# Altium schematic sheet LCDTFT_CTRL_FT813.SchDoc
size A3
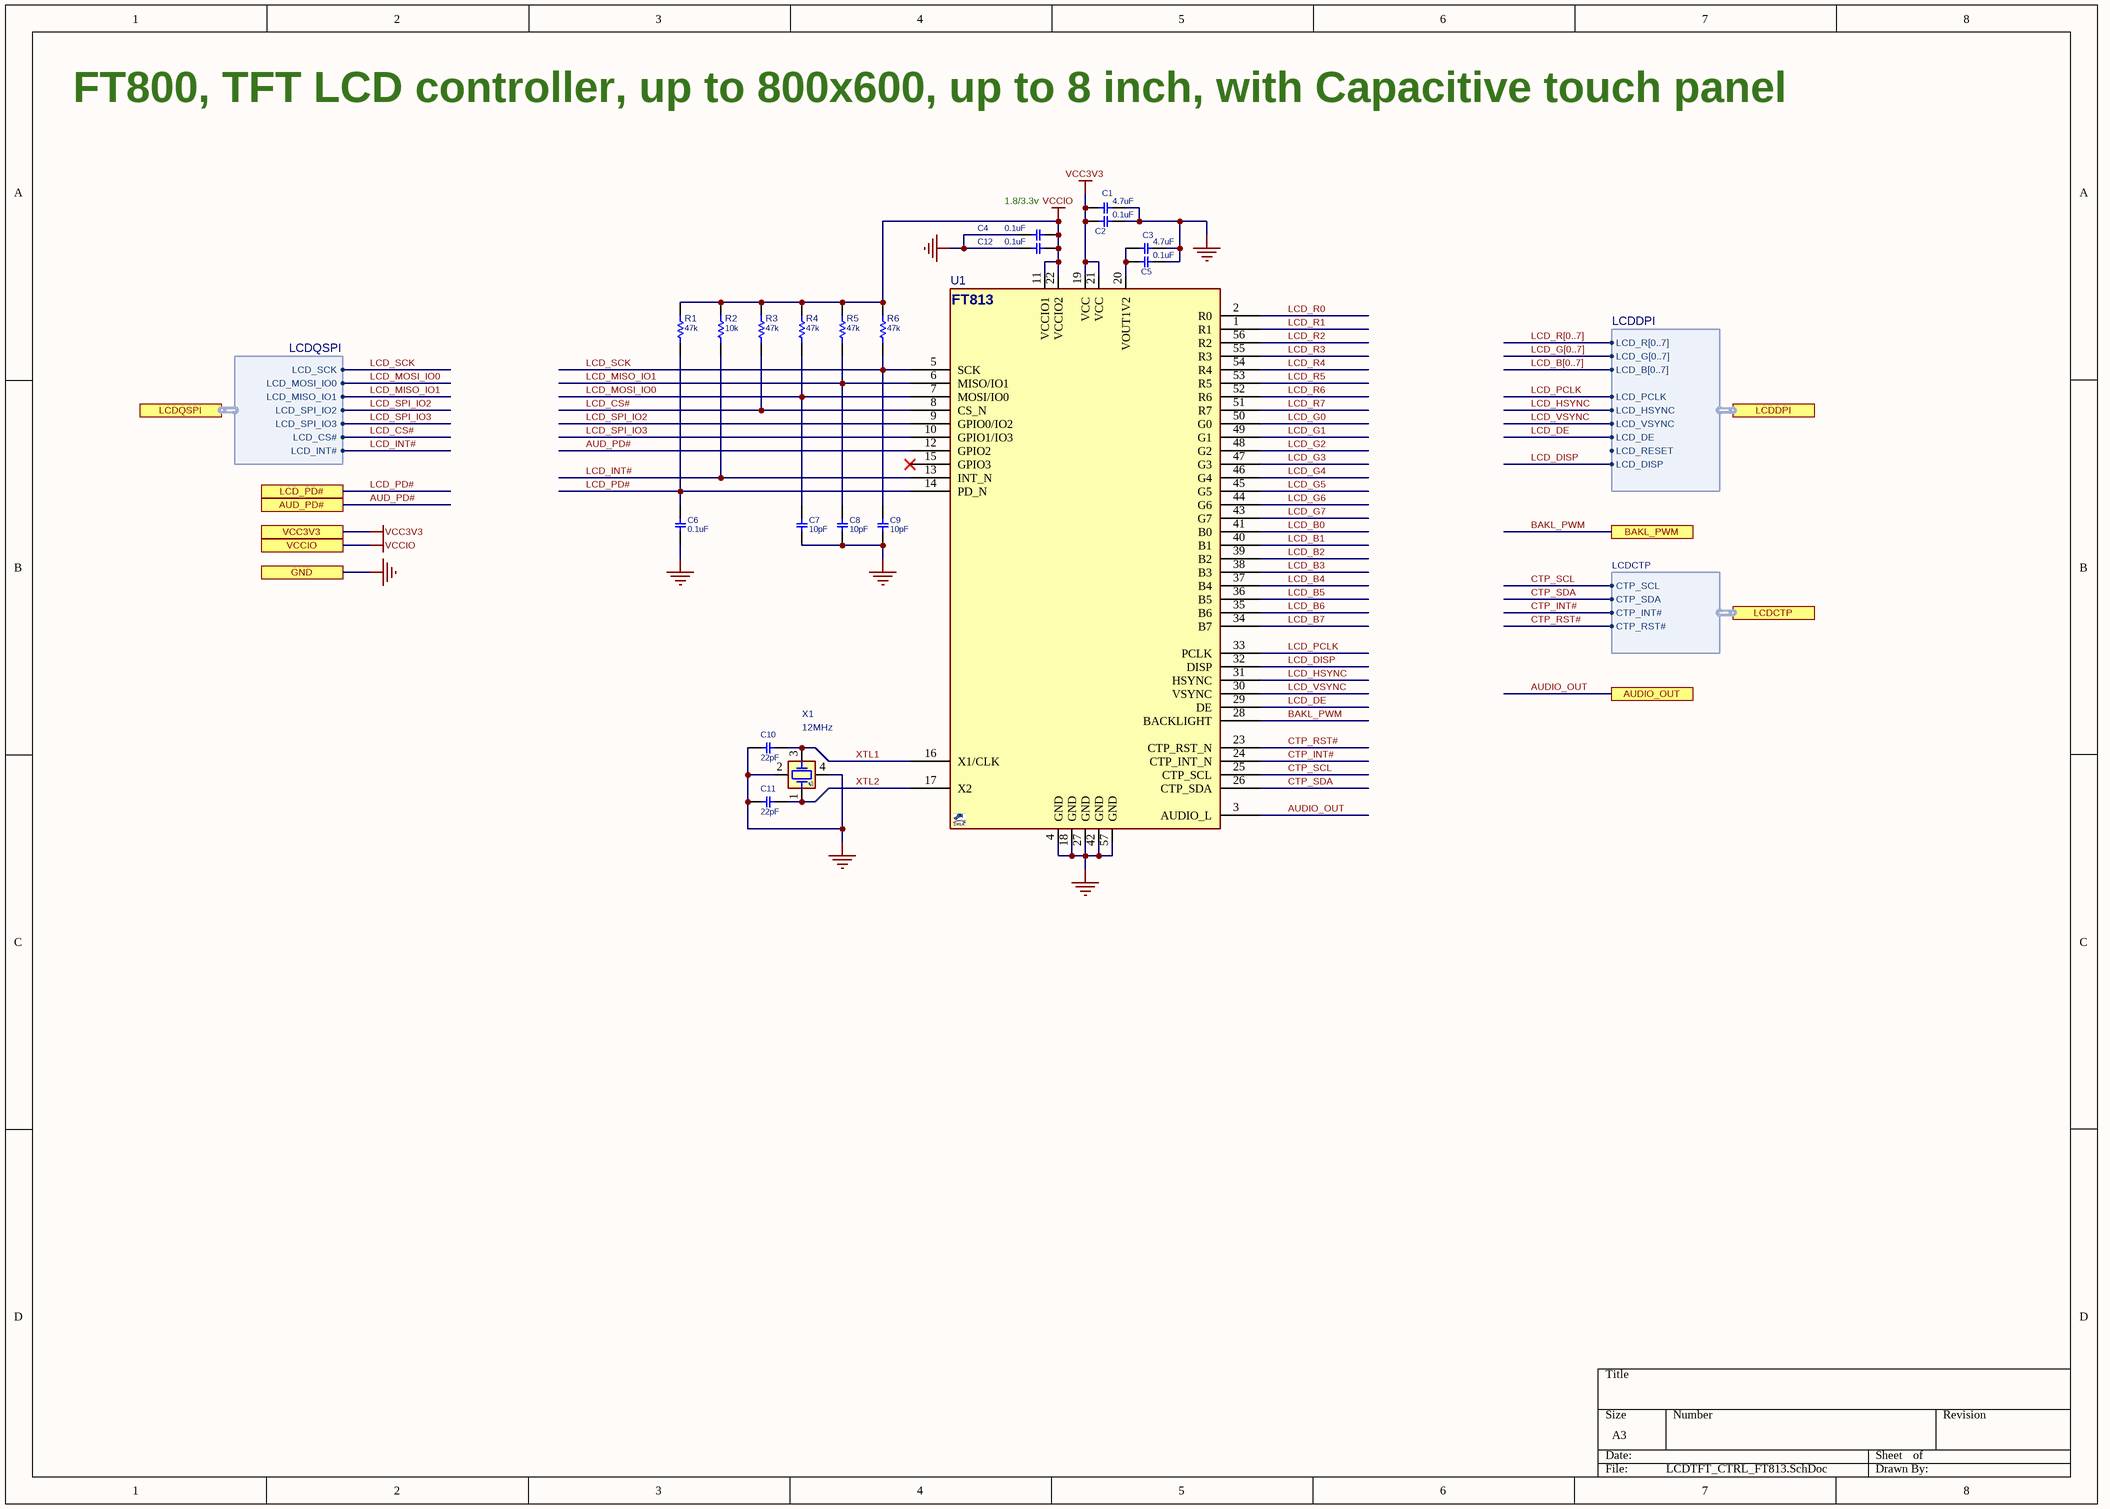
[diagram p0: LCDTFT_CTRL_FT813.SchDoc]

## Parts
C1  4.7uF  [C0603]
C2  0.1uF  [C0402]
C3  4.7uF  [C0603]
C4  0.1uF  [C0402]
C5  0.1uF  [C0402]
C6  0.1uF  [C0402]
C7  10pF  [C0402]
C8  10pF  [C0402]
C9  10pF  [C0402]
C10  22pF  [C0402]
C11  22pF  [C0402]
C12  0.1uF  [C0402]
R1  47k  [R0402]
R2  10k  [R0402]
R3  47k  [R0402]
R4  47k  [R0402]
R5  47k  [R0402]
R6  47k  [R0402]
U1  FT813  [QFN50_56T]  (value not drawn)
X1  12MHz  [XTL_4_3225]

## Ports
AUD_PD#, AUDIO_OUT, BAKL_PWM, GND, LCD_PD#, LCDCTP (harness LCDCTP), LCDDPI (harness LCDDPI), LCDQSPI (harness LCDQSPI), VCC3V3, VCCIO

## Harnesses
LCDDPI: LCD_PCLK, LCD_HSYNC, LCD_VSYNC, LCD_DE, LCD_R[0..7], LCD_G[0..7], LCD_B[0..7], LCD_RESET, LCD_DISP
LCDQSPI: LCD_SCK, LCD_MISO_IO1, LCD_MOSI_IO0, LCD_SPI_IO2, LCD_SPI_IO3, LCD_CS#, LCD_INT#
LCDCTP: CTP_SCL, CTP_SDA, CTP_INT#, CTP_RST#

## Nets
GND: C1.1 C2.1 C3.1 C4.2 C5.1 C6.2 C7.2 C8.2 C9.2 C10.1 C11.2 C12.2 U1.4(GND) U1.18(GND) U1.27(GND) U1.42(GND) U1.57(GND) X1.2 X1.4 ; port GND
VCC3V3: C1.2 C2.2 U1.19(VCC) U1.21(VCC) ; port VCC3V3
VCCIO: C4.1 C12.1 R1.1 R2.1 R3.1 R4.1 R5.1 R6.1 U1.11(VCCIO1) U1.22(VCCIO2) ; port VCCIO
AUD_PD#: U1.12(GPIO2) ; port AUD_PD#
AUDIO_OUT: U1.3(AUDIO_L) ; port AUDIO_OUT
BAKL_PWM: U1.28(BACKLIGHT) ; port BAKL_PWM
CTP_INT#: U1.24(CTP_INT_N) ; port LCDCTP.CTP_INT#
CTP_RST#: U1.23(CTP_RST_N) ; port LCDCTP.CTP_RST#
CTP_SCL: U1.25(CTP_SCL) ; port LCDCTP.CTP_SCL
CTP_SDA: U1.26(CTP_SDA) ; port LCDCTP.CTP_SDA
LCD_B0: U1.41(B0)
LCD_B1: U1.40(B1)
LCD_B2: U1.39(B2)
LCD_B3: U1.38(B3)
LCD_B4: U1.37(B4)
LCD_B5: U1.36(B5)
LCD_B6: U1.35(B6)
LCD_B7: U1.34(B7)
LCD_CS#: R3.2 U1.8(CS_N) ; port LCDQSPI.LCD_CS#
LCD_DE: U1.29(DE) ; port LCDDPI.LCD_DE
LCD_DISP: U1.32(DISP) ; port LCDDPI.LCD_DISP
LCD_G0: U1.50(G0)
LCD_G1: U1.49(G1)
LCD_G2: U1.48(G2)
LCD_G3: U1.47(G3)
LCD_G4: U1.46(G4)
LCD_G5: U1.45(G5)
LCD_G6: U1.44(G6)
LCD_G7: U1.43(G7)
LCD_HSYNC: U1.31(HSYNC) ; port LCDDPI.LCD_HSYNC
LCD_INT#: R2.2 U1.13(INT_N) ; port LCDQSPI.LCD_INT#
LCD_MISO_IO1: C8.1 R5.2 U1.6(MISO/IO1) ; port LCDQSPI.LCD_MISO_IO1
LCD_MOSI_IO0: C7.1 R4.2 U1.7(MOSI/IO0) ; port LCDQSPI.LCD_MOSI_IO0
LCD_PCLK: U1.33(PCLK) ; port LCDDPI.LCD_PCLK
LCD_PD#: C6.1 R1.2 U1.14(PD_N) ; port LCD_PD#
LCD_R0: U1.2(R0)
LCD_R1: U1.1(R1)
LCD_R2: U1.56(R2)
LCD_R3: U1.55(R3)
LCD_R4: U1.54(R4)
LCD_R5: U1.53(R5)
LCD_R6: U1.52(R6)
LCD_R7: U1.51(R7)
LCD_SCK: C9.1 R6.2 U1.5(SCK) ; port LCDQSPI.LCD_SCK
LCD_SPI_IO2: U1.9(GPIO0/IO2) ; port LCDQSPI.LCD_SPI_IO2
LCD_SPI_IO3: U1.10(GPIO1/IO3) ; port LCDQSPI.LCD_SPI_IO3
LCD_VSYNC: U1.30(VSYNC) ; port LCDDPI.LCD_VSYNC
XTL1: C10.2 U1.16(X1/CLK) X1.3
XTL2: C11.1 U1.17(X2) X1.1
NetC3_2: C3.2 C5.2 U1.20(VOUT1V2)

Not connected (* = marked no-connect by the designer): U1 15(GPIO3)*

## Buses and harness runs
bus LCD_B[0..7]
bus LCD_G[0..7]
bus LCD_R[0..7]

## Notes on the sheet
- FT800, TFT LCD controller, up to 800x600, up to 8 inch, with Capacitive touch panel
- 1.8/3.3v

## Library data of the parts
C1 C3 = CAP_SMD_MLCC: CAP, MLCC; PARAM: X5R, 10%; PRICE: 50,000:	$0.006; MANF_P#: -; MANF: -; PARAM2: -; ASSEMBLY: ASSEMBLY; VALUE: 4.7uF
C2 C4-C6 C12 = CAP_SMD_MLCC: CAP, MLCC; PARAM: X7R, 10%, -55~125oC; MANF_P#: GRM155R71H104KE14D; MANF: Murata; PARAM2: 50v; PRICE: 100: 0.018$; ASSEMBLY: ASSEMBLY; VALUE: 0.1uF
C7-C11 = CAP_SMD_MLCC: CAP, MLCC; PARAM2: 50v; PARAM: -; PRICE: 100: 0.018$; MANF_P#: -; MANF: -; ASSEMBLY: ASSEMBLY
  C7-C9: VALUE: 10pF
  C10 C11: VALUE: 22pF
R1-R6 = RES_SMD: RESISTOR, SMD; PARAM: 0.063W; DESC: DESCRIPTION; DIST#: MOUSER; PARAM2: 1%; MANF_P#: -; MANF: -; ASSEMBLY: ASSEMBLY; PRICE: 100= 0.3$
  R1 R3-R6: VALUE: 47k
  R2: VALUE: 10k
U1 = FT813_QFN56: LCD Display Controller, Embedded Video Engine, QFN-56; MANF: FTDI/Bridgetek; MANF_P#: FT813Q; PARAM2: 1.8~3.3Vcc; PARAM: -40~85°C; PRICE: 5$; VALUE: FT813
X1 = XTL_4_12MHz_3225: Crystal 12MHz; MANF: ECS; MANF_P#: ECS-120-18-33-JEM-TR; PARAM: 20PPM, 18pF; PRICE: 0.5$; VALUE: 12MHz